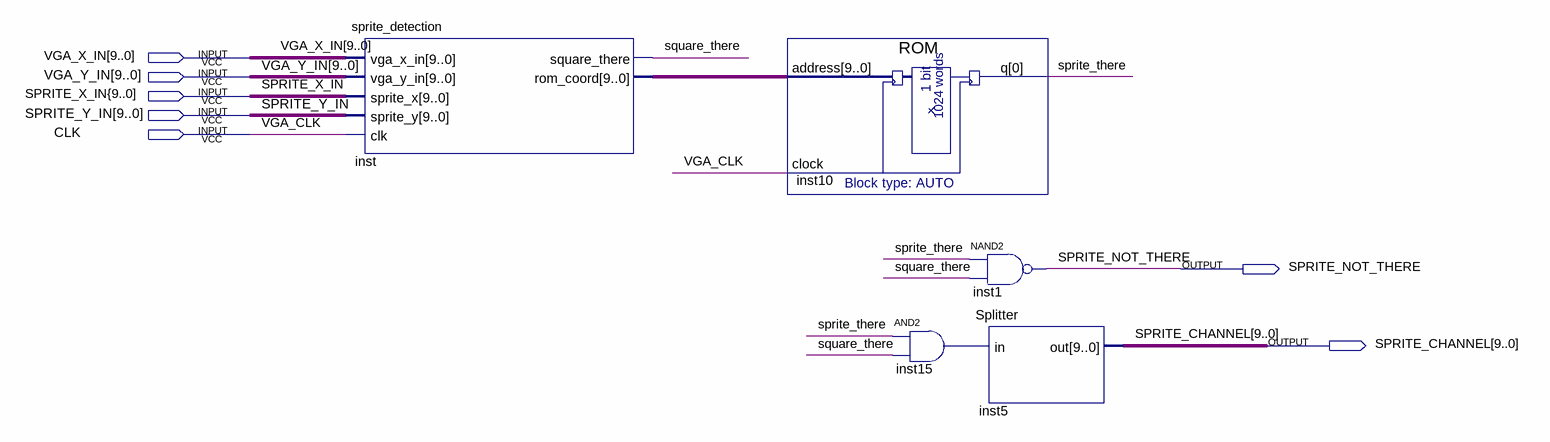
[diagram p0: schematic sheet]
// Quartus schematic sprite_channel.bdf as structural Verilog: 5 symbols, 7 pins
module sprite_channel (
  input  [9:0] VGA_X_IN,
  input  [9:0] VGA_Y_IN,
  input  \SPRITE_X_IN{9..0] ,
  input  [9:0] SPRITE_Y_IN,
  input  CLK,
  output SPRITE_NOT_THERE,
  output [9:0] SPRITE_CHANNEL
);

  wire inst15_out, sprite_there, SPRITE_Y_IN_1bit, square_there;
  wire [9:0] inst_rom_coord;

  sprite_detection inst (
    .vga_x_in(VGA_X_IN), .vga_y_in(VGA_Y_IN), .sprite_x({10{\SPRITE_X_IN{9..0] }}),
    .sprite_y({10{SPRITE_Y_IN_1bit}}), .clk(CLK), .square_there(square_there), .rom_coord(inst_rom_coord));
  ROM inst10 (.address(inst_rom_coord), .clock(CLK), .q(sprite_there));
  and inst15 (inst15_out, sprite_there, square_there);
  nand inst1 (SPRITE_NOT_THERE, sprite_there, square_there);
  Splitter inst5 (.in(inst15_out), .out(SPRITE_CHANNEL));

  // Other names for the same wires on the sheet: SPRITE_X_IN = \SPRITE_X_IN{9..0] ; VGA_CLK = CLK
endmodule
